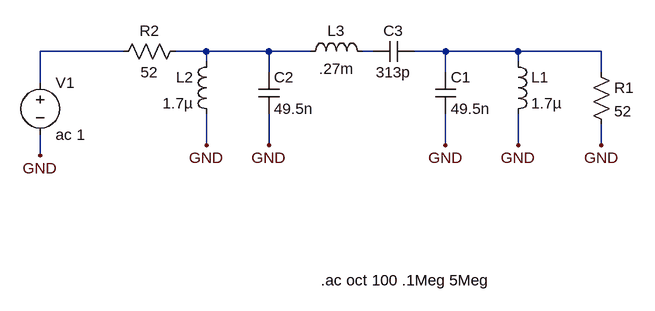
[diagram p0: schematic IFfilter2.asc]
IFfilter2.asc, the LTspice schematic file:
Version 4
SHEET 1 2920 1376
WIRE 2256 1152 2256 1104
WIRE 2256 1024 2256 1008
WIRE 2256 1008 2352 1008
WIRE 2496 1008 2512 1008
WIRE 2576 1008 2624 1008
WIRE 2736 1008 2736 1024
WIRE 2736 1104 2736 1152
WIRE 2352 1152 2352 1104
WIRE 2352 1040 2352 1008
WIRE 2352 1008 2416 1008
WIRE 2624 1008 2624 1040
WIRE 2624 1104 2624 1152
WIRE 2624 1008 2736 1008
WIRE 2736 1008 2864 1008
WIRE 2864 1008 2864 1040
WIRE 2864 1120 2864 1152
WIRE 2256 1008 2208 1008
WIRE 2128 1008 2000 1008
WIRE 2000 1008 2000 1056
WIRE 2000 1136 2000 1168
FLAG 2736 1152 GND
FLAG 2624 1152 GND
FLAG 2352 1152 GND
FLAG 2256 1152 GND
FLAG 2864 1152 GND
FLAG 2000 1168 GND
SYMBOL ind 2720 1008 R0
SYMATTR InstName L1
SYMATTR Value 1.7µ
SYMBOL cap 2608 1040 R0
SYMATTR InstName C1
SYMATTR Value 49.5n
SYMBOL cap 2336 1040 R0
SYMATTR InstName C2
SYMATTR Value 49.5n
SYMBOL ind 2272 1008 M0
SYMATTR InstName L2
SYMATTR Value 1.7µ
SYMBOL ind 2400 1024 R270
WINDOW 0 32 56 VTop 0
WINDOW 3 5 56 VBottom 0
SYMATTR InstName L3
SYMATTR Value .27m
SYMBOL cap 2576 992 R90
WINDOW 0 0 32 VBottom 0
WINDOW 3 32 32 VTop 0
SYMATTR InstName C3
SYMATTR Value 313p
SYMBOL res 2848 1024 R0
SYMATTR InstName R1
SYMATTR Value 52
SYMBOL res 2224 992 R90
WINDOW 0 0 56 VBottom 0
WINDOW 3 32 56 VTop 0
SYMATTR InstName R2
SYMATTR Value 52
SYMBOL voltage 2000 1040 R0
SYMATTR InstName V1
SYMATTR Value ac 1
text 2432 1360 Left 0 !.ac oct 100 .1Meg 5Meg

The netlist it stands for:
* IFfilter2.asc
L1 N003 GND 1.7µ
C1 N003 GND 49.5n
C2 N001 GND 49.5n
L2 N001 GND 1.7µ
L3 N001 N002 .27m
C3 N003 N002 313p
R1 N003 GND 52
R2 N001 N004 52
V1 N004 GND ac 1
.ac oct 100 .1Meg 5Meg
.backanno
.end